# EAGLE schematic compare1.2 (EAGLE 6.6.0)
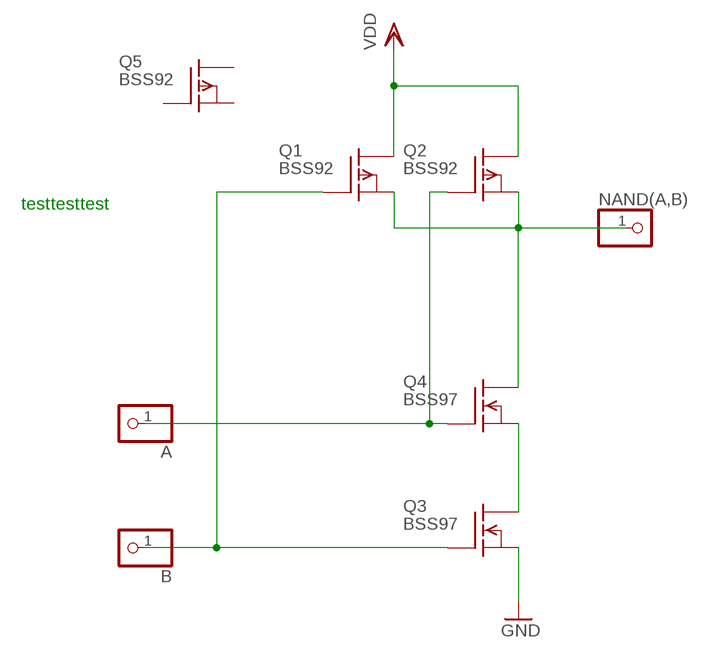
[diagram p0: schematic, sheet 1]

## Parts
A  PINHD-1X1  [1X01]
B  PINHD-1X1  [1X01]
NAND(A,B)  PINHD-1X1  [1X01]
Q1  BSS92  [TO92]
Q2  BSS92  [TO92]
Q3  BSS97  [TO202]
Q4  BSS97  [TO202]
Q5  BSS92  [TO92]

## Nets
ATEST: A.1 Q2.1(G) Q4.3(G)
B: B.1 Q1.1(G) Q3.3(G)
GND: Q3.1(S)
N$2: Q3.2(D) Q4.1(S)
NAND(A,B): NAND(A,B).1 Q1.3(S) Q2.3(S) Q4.2(D)
VDD: Q1.2(D) Q2.2(D)
Unconnected: Q5.1(G) Q5.2(D) Q5.3(S)

## Notes on the sheet
- testtesttest

## Library data of the parts
A B NAND(A,B) = pinhead:PINHD-1X1: PIN HEADER
Q1 = transistor-fet:BSS92: P-Channel Enhancement MOSFET -200V; -0,15A; 11Ohm; P1: 0001; TEST2: 5; UID: 8
Q2 = transistor-fet:BSS92: P-Channel Enhancement MOSFET -200V; -0,15A; 11Ohm; P2: 0002
Q3 Q4 = transistor-fet:BSS97: N-Channel Enhancement MOSFET 200V; 1.5A; 1,6Ohm
Q5 = transistor-fet:BSS92: P-Channel Enhancement MOSFET -200V; -0,15A; 11Ohm; UID: 8